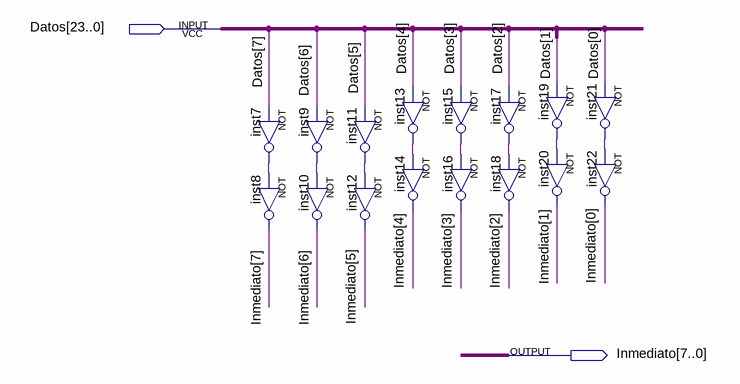
[diagram p0: schematic sheet]
// Quartus schematic BloqueValorInmediato.bdf as structural Verilog: 16 symbols, 2 pins
module BloqueValorInmediato (
  input  [23:0] Datos,
  output [7:0] Inmediato
);

  wire inst7_out, inst9_out, inst11_out, inst13_out, inst15_out, inst17_out, inst19_out, inst21_out;

  not inst7 (inst7_out, Datos[7]);
  not inst9 (inst9_out, Datos[6]);
  not inst8 (Inmediato[7], inst7_out);
  not inst10 (Inmediato[6], inst9_out);
  not inst13 (inst13_out, Datos[4]);
  not inst11 (inst11_out, Datos[5]);
  not inst14 (Inmediato[4], inst13_out);
  not inst12 (Inmediato[5], inst11_out);
  not inst15 (inst15_out, Datos[3]);
  not inst16 (Inmediato[3], inst15_out);
  not inst19 (inst19_out, Datos[1]);
  not inst17 (inst17_out, Datos[2]);
  not inst20 (Inmediato[1], inst19_out);
  not inst18 (Inmediato[2], inst17_out);
  not inst21 (inst21_out, Datos[0]);
  not inst22 (Inmediato[0], inst21_out);
endmodule
